# Altium project CESE Projecto Final.PrjPcb
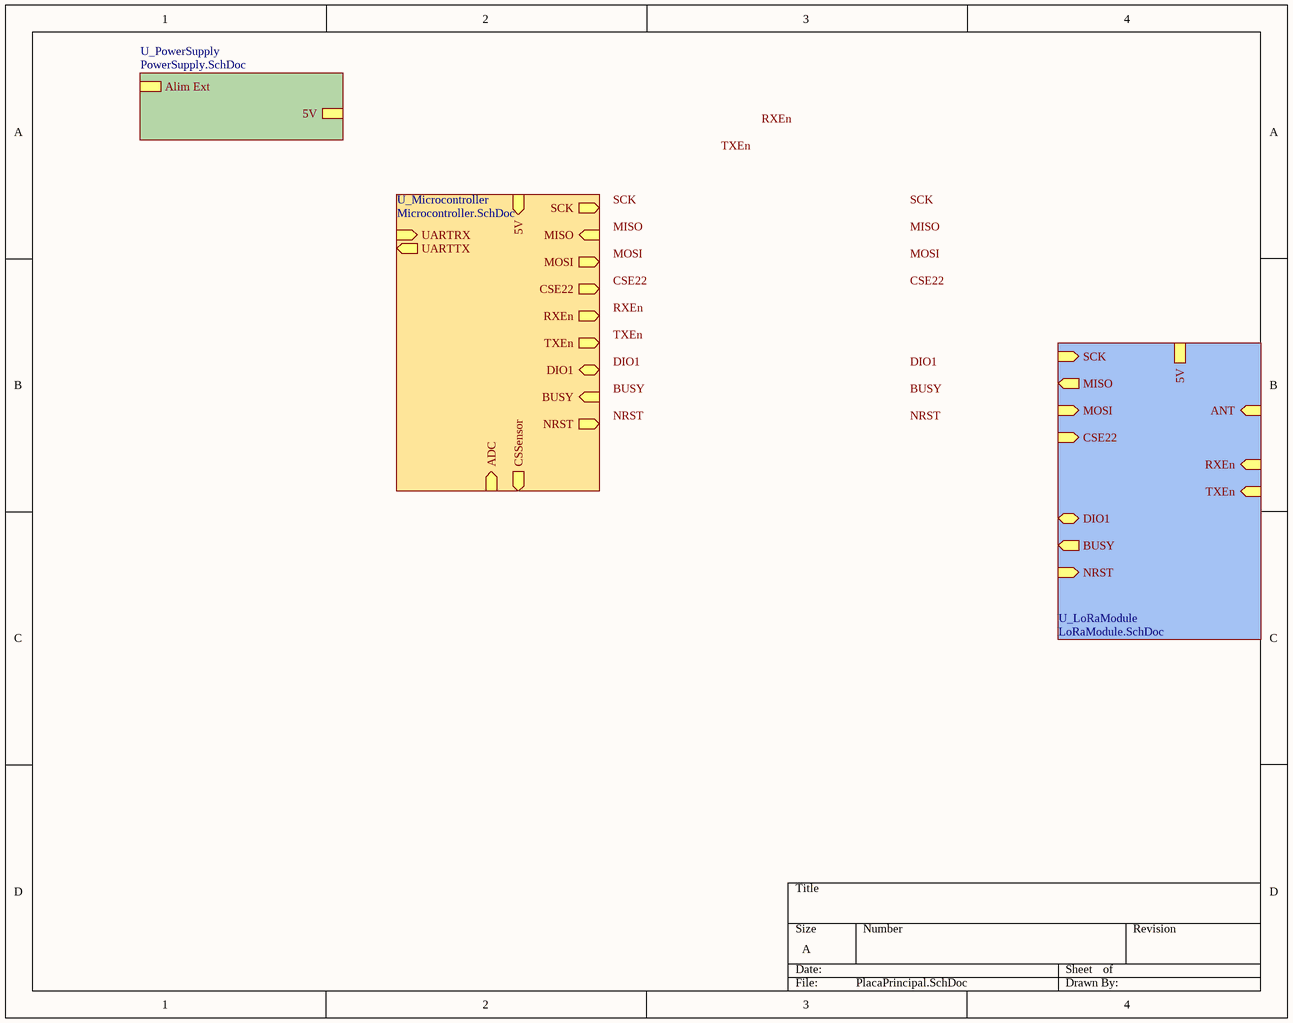
[diagram p0: PlacaPrincipal.SchDoc]
4 sheets, 43 parts. Net scope: hierarchical (ports join the sheet entries above them; power ports are global).
Board file: PlacaPrincipal.PcbDoc
Sheets:
  PlacaPrincipal.SchDoc
    U_PowerSupply = PowerSupply.SchDoc
    U_Microcontroller = Microcontroller.SchDoc
    U_LoRaModule = LoRaModule.SchDoc

## Sheet PlacaPrincipal.SchDoc
size A; SheetNumber: 1; SheetTotal: 4

### Sub-sheets
U_LoRaModule = LoRaModule.SchDoc: SCK (in), MOSI (in), MISO (out), CSE22 (in), TXEn (in), BUSY (out), DIO1 (bidir), ANT (in), NRST (in), 5V, RXEn (in)
U_Microcontroller = Microcontroller.SchDoc: MOSI (out), CSE22 (out), UARTRX (in), TXEn (out), BUSY (in), DIO1 (bidir), NRST (out), ADC (in), UARTTX (out), CSSensor (out), MISO (in), 5V (in), SCK (out), RXEn (out)
U_PowerSupply = PowerSupply.SchDoc: Alim Ext, 5V

### Nets
+5: sheet U_Microcontroller/5V, sheet U_LoRaModule/5V

### Notes on the sheet
- Labels drawn without touching a wire or pin: BUSY, CSE22, DIO1, MISO, MOSI, NRST, RXEn, SCK, TXEn

## Sheet PowerSupply.SchDoc
size A; SheetNumber: 2; SheetTotal: 4
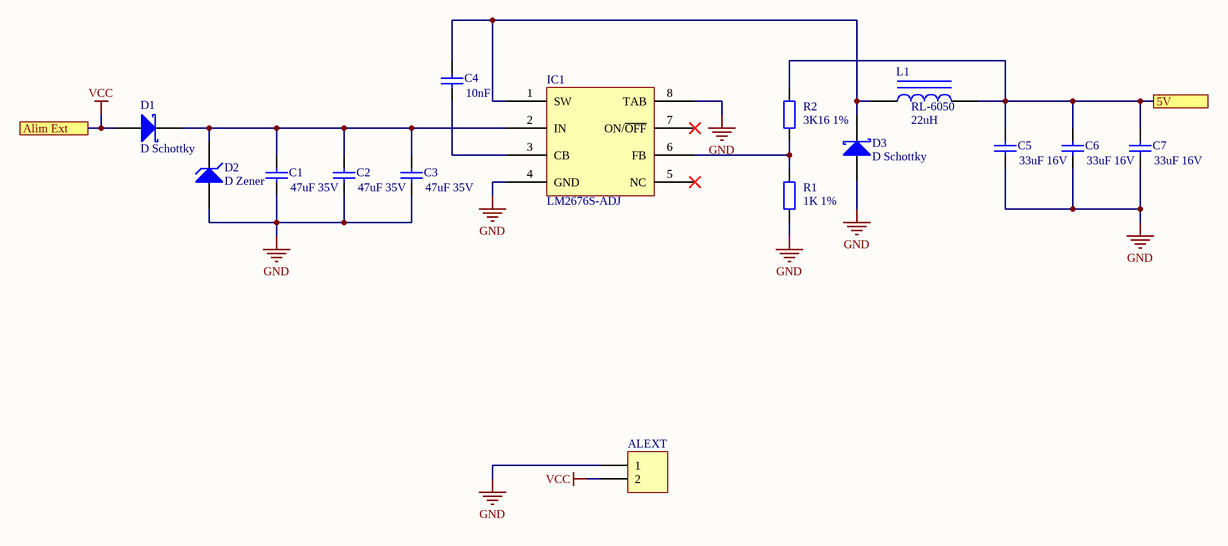
[diagram p1: PowerSupply.SchDoc]

### Parts
ALEXT  Header 2  [CONN HEADER VERT 2POS 3.96MM]  (value not drawn)
C1  value 47uF 35V  [KEMET Case D]  (hidden comment: Cap)
C2  value 47uF 35V  [KEMET Case D]  (hidden comment: Cap)
C3  value 47uF 35V  [KEMET Case D]  (hidden comment: Cap)
C4  value 10nF  [RES0805]  (hidden comment: Cap)
C5  value 33uF 16V  [RES 1206]  (hidden comment: Cap)
C6  value 33uF 16V  [RES 1206]  (hidden comment: Cap)
C7  value 33uF 16V  [RES 1206]  (hidden comment: Cap)
D1  D Schottky  [SMB]
D2  D Zener  [SMB]
D3  D Schottky  [SMB]
IC1  LM2676S-ADJ  [DPAK127P1435X464-8N]
L1  RL-6050  value 22uH  [RL-6050]
R1  value 1K 1%  [RES0805]  (hidden comment: Res2)
R2  value 3K16 1%  [RES0805]  (hidden comment: Res2)

### Ports
5V, Alim Ext

### Nets
GND: ALEXT.1 C1.2 C2.2 C3.2 C5.1 C6.1 C7.1 D2.1(A) D3.1(A) IC1.4(GND) IC1.8(TAB) R1.1
VCC: ALEXT.2 D1.1(A) ; port Alim Ext
NetC1_1: C1.1 C2.1 C3.1 D1.2(K) D2.2(K) IC1.2(IN)
NetC4_1: C4.1 IC1.3(CB)
NetC4_2: C4.2 D3.2(K) IC1.1(SW) L1.1
NetC5_2: C5.2 C6.2 C7.2 L1.2 R2.2 ; port 5V
NetIC1_6: IC1.6(FB) R1.2 R2.1

Not connected (* = marked no-connect by the designer): IC1 5(NC)* 7(ON/~{OFF})*

### Library data of the parts
ALEXT = Header 2: Header, 2-Pin; LatestRevisionDate: 17-Jul-2002; LatestRevisionNote: Re-released for DXP Platform.; Publisher: Altium Limited
C1-C7 = Cap: Capacitor; Published: 8-Jun-2000; LatestRevisionDate: 17-Jul-2002; LatestRevisionNote: Re-released for DXP Platform.; Publisher: Altium Limited
  C1-C3: PackageReference: SMD,D6.3xL5.4mm; PackageDescription: SMD,D6.3xL5.4mm; LCSC Part #: C110229
  C4: PackageReference: 0805; PackageDescription: 0805; LCSC Part #: C1710
  C5-C7: PackageReference: 1206; PackageDescription: 1206
D1 D3 = D Schottky: B340B-13-F; Published: 8-Jun-2000; LatestRevisionDate: 17-Jul-2002; LatestRevisionNote: Re-released for DXP Platform.; PackageReference: SMB; Publisher: Altium Limited; PackageDescription: DO-214-AA/SMB; 2 C-Bend Leads; Body 5.3 x 3.6 mm, inc. leads (LxW); LCSC Part #: C85099; Value: B340B-13-F
D2 = D Zener: SMBJ24A; Published: 8-Jun-2000; LatestRevisionDate: 17-Jul-2002; LatestRevisionNote: Re-released for DXP Platform.; PackageReference: SMB; Publisher: Altium Limited; PackageDescription: DO-214-AA/SMB; 2 C-Bend Leads; Body 5.3 x 3.6 mm, inc. leads (LxW); LCSC Part #: C3018876; Value: SMBJ24A
IC1 = LM2676S-ADJ: The LM2676 series of regulators are monolithic / integrated circuits which provide all of the active / functions for a step-down (buck) switching regulator / capable of driving up to 3-A loads with excellent line / and load regulation characteristics.; Datasheet: https://www.ti.com/lit/ds/symlink/lm2676.pdf?HQS=dis-dk-null-digikeymode-dsf-pf-null-wwe&ts=1689865044741&ref_url=https%253A%252F%252Fwww.ti.com%252Fgeneral%252Fdocs%252Fsuppproductinfo.tsp%253FdistId%253D10%2526gotoUrl%253Dhttps%253A%252F%252Fwww.ti.com%252Flit%252Fgpn%252Flm2676
L1 = Inductor Iron: Magnetic-Core Inductor; Published: 24-Mar-1999; LatestRevisionDate: 17-Jul-2002; LatestRevisionNote: Re-released for DXP Platform.; PackageReference: AXIAL-0.9; Publisher: Altium Limited; PackageDescription: Axial Device, Thru-Hole; 2 Leads; 0.9 in Pin Spacing
R1 R2 = Res2: Resistor; Published: 8-Jun-2000; LatestRevisionDate: 17-Jul-2002; LatestRevisionNote: Re-released for DXP Platform.; PackageReference: 0805; Publisher: Altium Limited; PackageDescription: 0805
  R1: LCSC Part #: C416040
  R2: LCSC Part #: C170878

## Sheet Microcontroller.SchDoc
size A; SheetNumber: 3; SheetTotal: 4
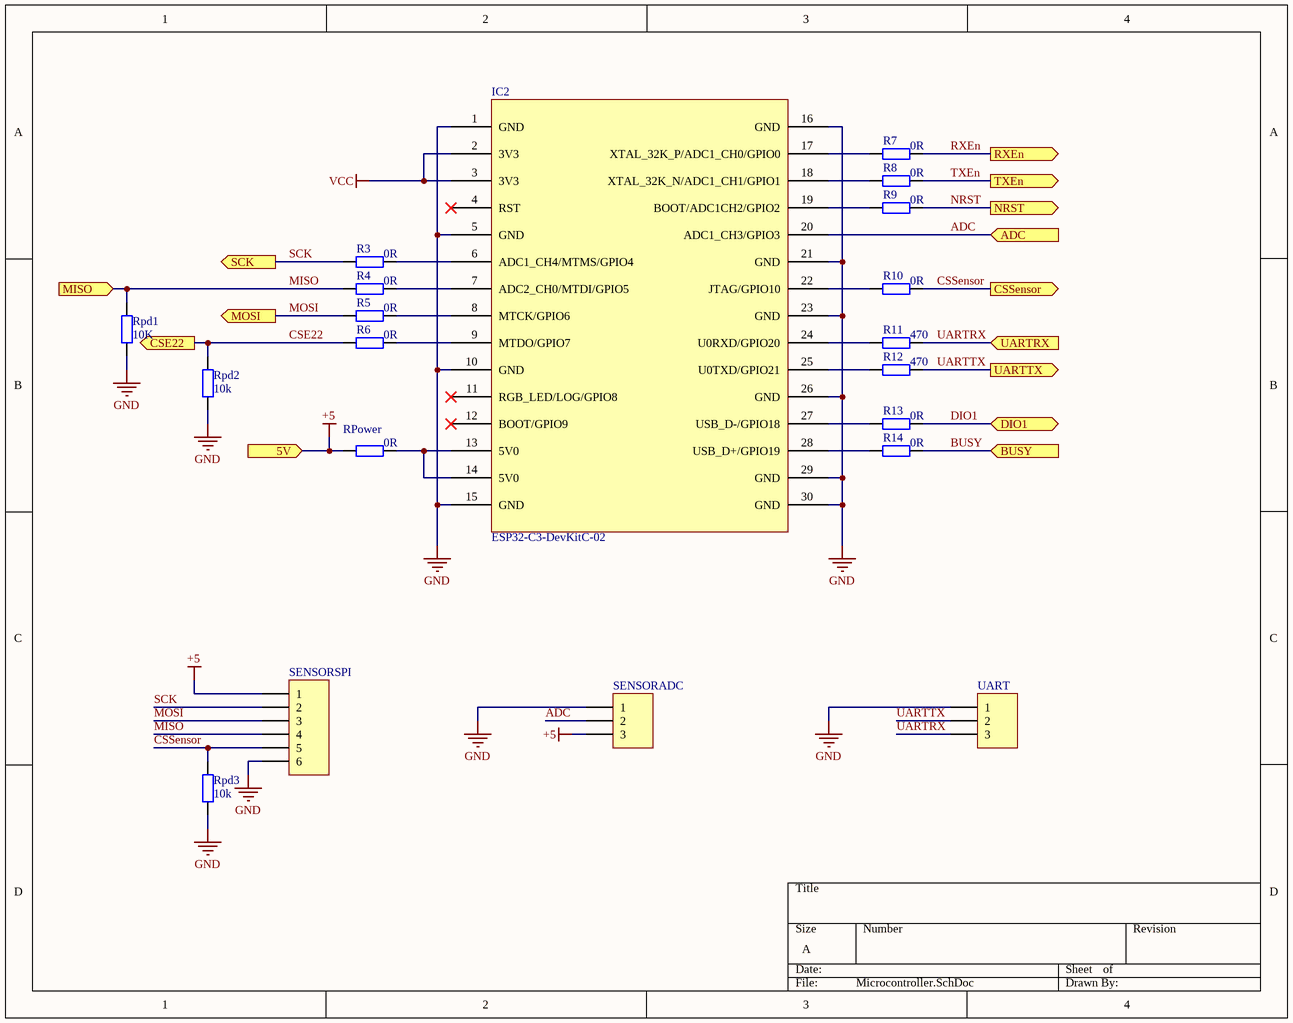
[diagram p2: Microcontroller.SchDoc]

### Parts
IC2  ESP32-C3-DevKitC-02  [ESP32-C3-DevKitC-02]
R3  value 0R  [RES0805]  (hidden comment: Res2)
R4  value 0R  [RES0805]  (hidden comment: Res2)
R5  value 0R  [RES0805]  (hidden comment: Res2)
R6  value 0R  [RES0805]  (hidden comment: Res2)
R7  value 0R  [RES0805]  (hidden comment: Res2)
R8  value 0R  [RES0805]  (hidden comment: Res2)
R9  value 0R  [RES0805]  (hidden comment: Res2)
R10  value 0R  [RES0805]  (hidden comment: Res2)
R11  value 470  [RES0805]  (hidden comment: Res2)
R12  value 470  [RES0805]  (hidden comment: Res2)
R13  value 0R  [RES0805]  (hidden comment: Res2)
R14  value 0R  [RES0805]  (hidden comment: Res2)
Rpd1  value 10K  [RES0805]  (hidden comment: Res2)
Rpd2  value 10k  [RES0805]  (hidden comment: Res2)
Rpd3  value 10k  [RES0805]  (hidden comment: Res2)
RPower  value 0R  [RES0805]  (hidden comment: Res2)
SENSORADC  Header 3  [Conn 1x3P]  (value not drawn)
SENSORSPI  Header 6  [Conn 1x6P]  (value not drawn)
UART  Header 3  [Conn 1x3P]  (value not drawn)

### Ports
5V (in), ADC (in), BUSY (in), CSE22 (out), CSSensor (out), DIO1 (bidir), MISO (in), MOSI (out), NRST (out), RXEn (out), SCK (out), TXEn (out), UARTRX (in), UARTTX (out)

### Nets
+5: RPower.1 SENSORADC.3 SENSORSPI.1 ; port 5V
GND: IC2.1(GND) IC2.5(GND) IC2.10(GND) IC2.15(GND) IC2.16(GND) IC2.21(GND) IC2.23(GND) IC2.26(GND) IC2.29(GND) IC2.30(GND) Rpd1.1 Rpd2.1 Rpd3.1 SENSORADC.1 SENSORSPI.6 UART.1
VCC: IC2.2(3V3) IC2.3(3V3)
ADC: IC2.20(ADC1_CH3/GPIO3) SENSORADC.2 ; port ADC
BUSY: R14.2 ; port BUSY
CSE22: R6.1 Rpd2.2 ; port CSE22
CSSensor: R10.2 Rpd3.2 SENSORSPI.5 ; port CSSensor
DIO1: R13.2 ; port DIO1
MISO: R4.1 Rpd1.2 SENSORSPI.4 ; port MISO
MOSI: R5.1 SENSORSPI.3 ; port MOSI
NRST: R9.2 ; port NRST
RXEn: R7.2 ; port RXEn
SCK: R3.1 SENSORSPI.2 ; port SCK
TXEn: R8.2 ; port TXEn
UARTRX: R11.2 UART.3 ; port UARTRX
UARTTX: R12.2 UART.2 ; port UARTTX
NetIC2_6: IC2.6(ADC1_CH4/MTMS/GPIO4) R3.2
NetIC2_7: IC2.7(ADC2_CH0/MTDI/GPIO5) R4.2
NetIC2_8: IC2.8(MTCK/GPIO6) R5.2
NetIC2_9: IC2.9(MTDO/GPIO7) R6.2
NetIC2_13: IC2.13(5V0) IC2.14(5V0) RPower.2
NetIC2_17: IC2.17(XTAL_32K_P/ADC1_CH0/GPIO0) R7.1
NetIC2_18: IC2.18(XTAL_32K_N/ADC1_CH1/GPIO1) R8.1
NetIC2_19: IC2.19(BOOT/ADC1CH2/GPIO2) R9.1
NetIC2_22: IC2.22(JTAG/GPIO10) R10.1
NetIC2_24: IC2.24(U0RXD/GPIO20) R11.1
NetIC2_25: IC2.25(U0TXD/GPIO21) R12.1
NetIC2_27: IC2.27(USB_D-/GPIO18) R13.1
NetIC2_28: IC2.28(USB_D+/GPIO19) R14.1

Not connected (* = marked no-connect by the designer): IC2 4(RST)* 11(RGB_LED/LOG/GPIO8)* 12(BOOT/GPIO9)*

### Library data of the parts
IC2 = ESP32-C3-DevKitC-02: ESP32-C3-DevKitC-02 is an entry-level development board based on ESP32-C3-WROOM-02, a general-purpose module with 4 MB SPI flash. This board integrates complete Wi-Fi and Bluetooth LE functions.; Datasheet: https://docs.espressif.com/projects/esp-idf/en/latest/esp32c3/hw-reference/esp32c3/user-guide-devkitc-02.html
R3-R14 Rpd1-Rpd3 RPower = Res2: Resistor; Published: 8-Jun-2000; LatestRevisionDate: 17-Jul-2002; LatestRevisionNote: Re-released for DXP Platform.; PackageReference: 0805; Publisher: Altium Limited; PackageDescription: 0805; LCSC Part #: C2074219
SENSORADC UART = Header 3: Header, 3-Pin; LatestRevisionDate: 17-Jul-2002; LatestRevisionNote: Re-released for DXP Platform.; Publisher: Altium Limited
SENSORSPI = Header 6: Header, 6-Pin; LatestRevisionDate: 17-Jul-2002; LatestRevisionNote: Re-released for DXP Platform.; Publisher: Altium Limited

## Sheet LoRaModule.SchDoc
size A; SheetNumber: 4; SheetTotal: 4
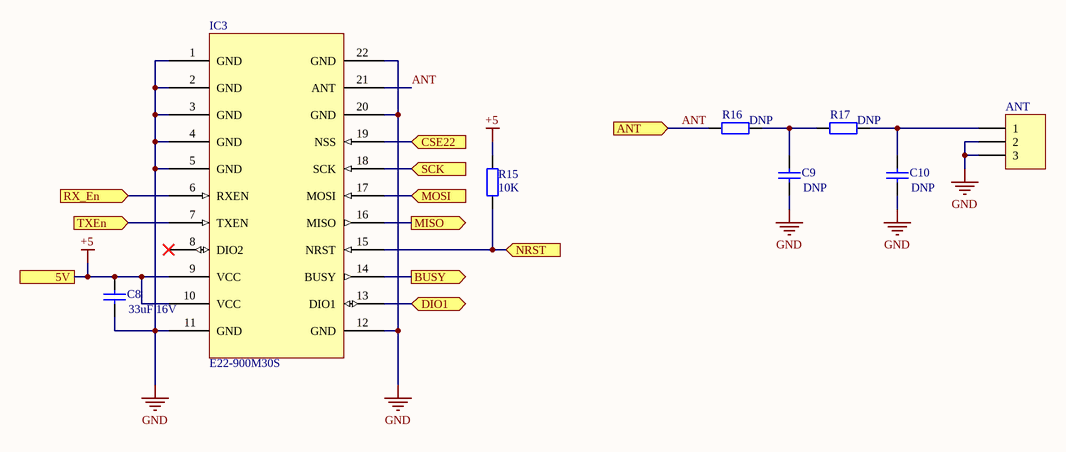
[diagram p3: LoRaModule.SchDoc]

### Parts
ANT  Header 3  [IPEX Board Conn]  (value not drawn)
C8  value 33uF 16V  [RES 1206]  (hidden comment: Cap)
C9  value DNP  [CAP0805]  (hidden comment: Cap)
C10  value DNP  [CAP0805]  (hidden comment: Cap)
IC3  E22-900M30S  [E22-900M30S]
R15  value 10K  [RES0805]  (hidden comment: Res2)
R16  value DNP  [RES0805]  (hidden comment: Res2)
R17  value DNP  [RES0805]  (hidden comment: Res2)

### Ports
5V, ANT (in), BUSY (out), CSE22 (in), DIO1 (bidir), MISO (out), MOSI (in), NRST (in), RX_En (in), SCK (in), TXEn (in)

### Nets
+5: C8.2 IC3.9(VCC) IC3.10(VCC) R15.2 ; port 5V
GND: ANT.2 ANT.3 C8.1 C9.1 C10.1 IC3.1(GND) IC3.2(GND) IC3.3(GND) IC3.4(GND) IC3.5(GND) IC3.11(GND) IC3.12(GND) IC3.20(GND) IC3.22(GND)
ANT: IC3.21(ANT) R16.1 ; port ANT
NetANT_1: ANT.1 C10.2 R17.2
NetC9_2: C9.2 R16.2 R17.1
NetIC3_6: IC3.6(RXEN) ; port RX_En
NetIC3_7: IC3.7(TXEN) ; port TXEn
NetIC3_13: IC3.13(DIO1) ; port DIO1
NetIC3_14: IC3.14(BUSY) ; port BUSY
NetIC3_15: IC3.15(NRST) R15.1 ; port NRST
NetIC3_16: IC3.16(MISO) ; port MISO
NetIC3_17: IC3.17(MOSI) ; port MOSI
NetIC3_18: IC3.18(SCK) ; port SCK
NetIC3_19: IC3.19(NSS) ; port CSE22

Not connected (* = marked no-connect by the designer): IC3 8(DIO2)*

### Library data of the parts
ANT = Header 3: Header, 3-Pin; LatestRevisionDate: 17-Jul-2002; LatestRevisionNote: Re-released for DXP Platform.; Publisher: Altium Limited; LCSC Part #: C88374
C8-C10 = Cap: Capacitor; Published: 8-Jun-2000; LatestRevisionDate: 17-Jul-2002; LatestRevisionNote: Re-released for DXP Platform.; PackageReference: 1206; Publisher: Altium Limited; PackageDescription: 1206
IC3 = E22-900M30S: The E22-900M30S is based on the SX1262, a new generation of / LoRaTM RF chip manufactured by Semtech, USA. It is an ultra-small / and self-developed 868MHz、915MHz SMD LoRaTM wireless module.; Datasheet: https://www.ebyte.com/en/downpdf.aspx?id=453
R15-R17 = Res2: Resistor; Published: 8-Jun-2000; LatestRevisionDate: 17-Jul-2002; LatestRevisionNote: Re-released for DXP Platform.; PackageReference: 0805; Publisher: Altium Limited; PackageDescription: 0805
  R15: LCSC Part #: C2930231

## Nets that join several sheets
+5: Microcontroller (RPower.1 SENSORADC.3 SENSORSPI.1), LoRaModule (C8.2 IC3.9 IC3.10 R15.2)
GND: PowerSupply (12 pins), Microcontroller (16 pins), LoRaModule (14 pins)
VCC: PowerSupply (ALEXT.2 D1.1), Microcontroller (IC2.2 IC2.3)